# Altium schematic sheet [17] Changelog.SchDoc: Hardware changelog
size A4; Engineer: M. Folejewski; DocumentNumber: 17; SheetNumber: 17; SheetTotal: 17; PageSize: A4; Designators: -
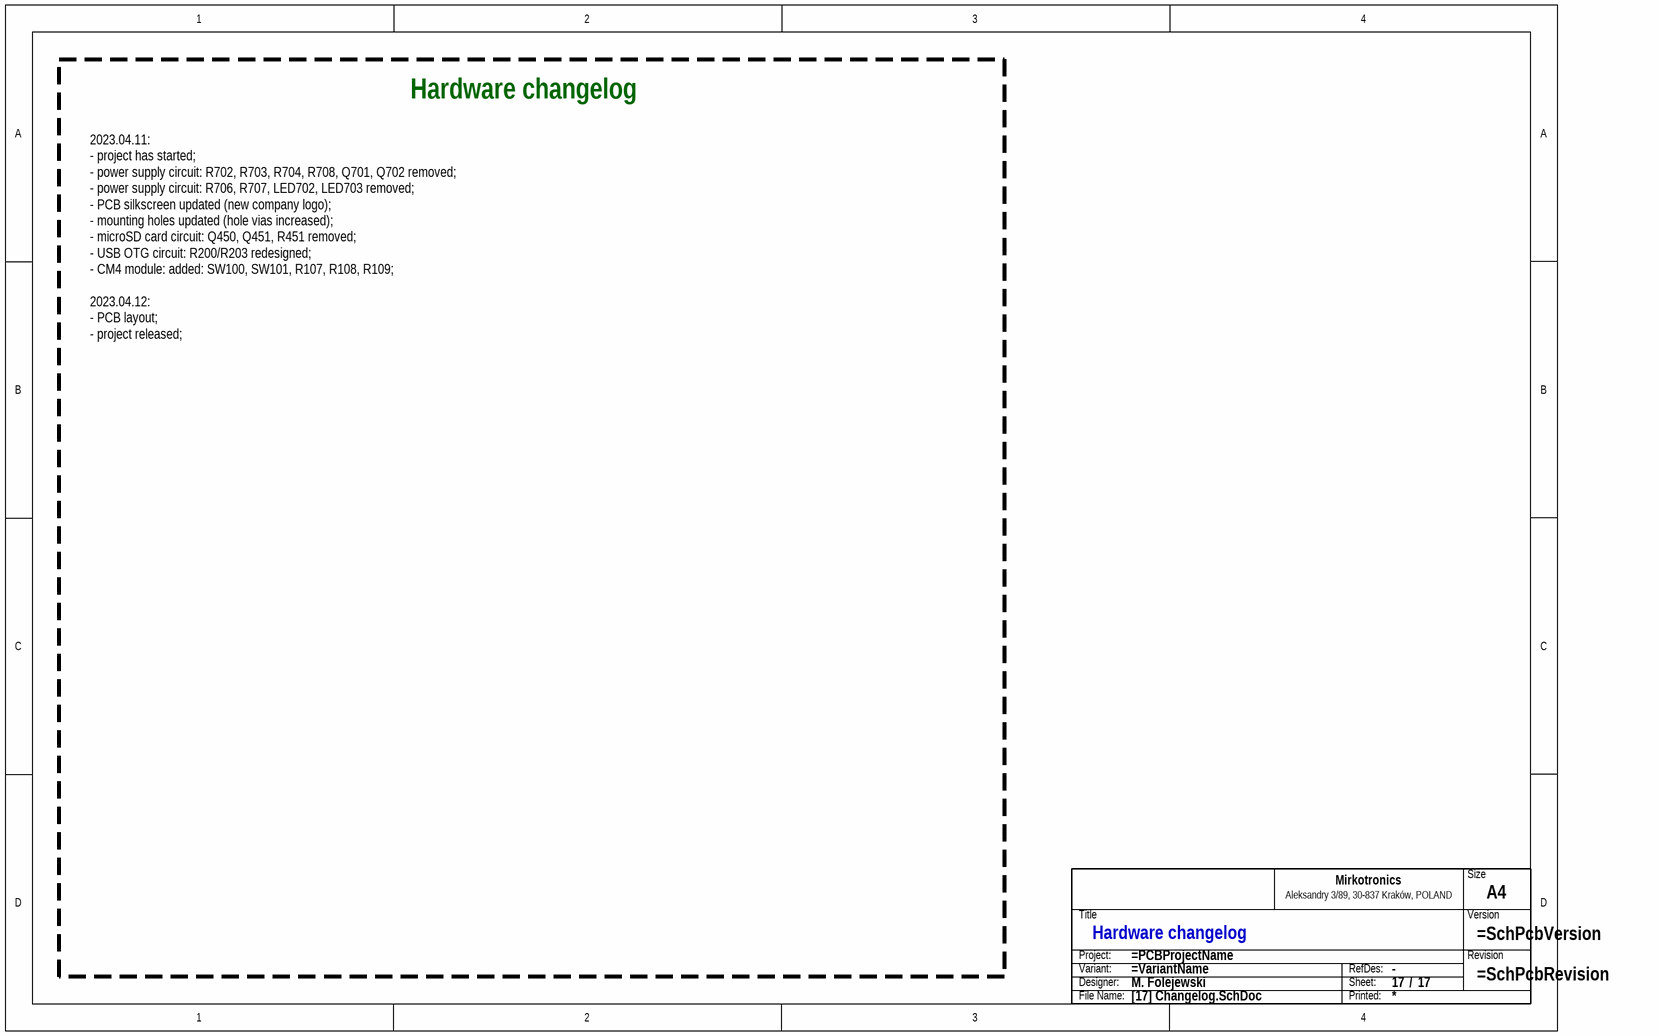
[diagram p0: [17] Changelog.SchDoc]

## Parts
TB?  Title block  (value not drawn)  (graphical)

## Notes on the sheet
- Hardware changelog
- 2023.04.11:
  - project has started;
  - power supply circuit: R702, R703, R704, R708, Q701, Q702 removed;
  - power supply circuit: R706, R707, LED702, LED703 removed;
  - PCB silkscreen updated (new company logo);
  - mounting holes updated (hole vias increased);
  - microSD card circuit: Q450, Q451, R451 removed;
  - USB OTG circuit: R200/R203 redesigned;
  - CM4 module: added: SW100, SW101, R107, R108, R109;
  2023.04.12:
  - PCB layout;
  - project released;
- (in symbol SCH_TITLE_BLOCK_MIRKOTRONICS_V2) Size; Mirkotronics; Aleksandry 3/89, 30-837 Kraków, POLAND; Title; Version; Project:; Revision; Variant:; RefDes:; Designer:; Sheet:; /; File Name:; Printed:

## Library data of the parts
TB? = SCH_TITLE_BLOCK_MIRKOTRONICS_V2: Component Type: Title block; Manufacturer: -; Mounting Type: Non component; MPN: -; Operating Temperature: -; Package: -; Specification: Title block; Value: Title block; Replacement: -; System: ?